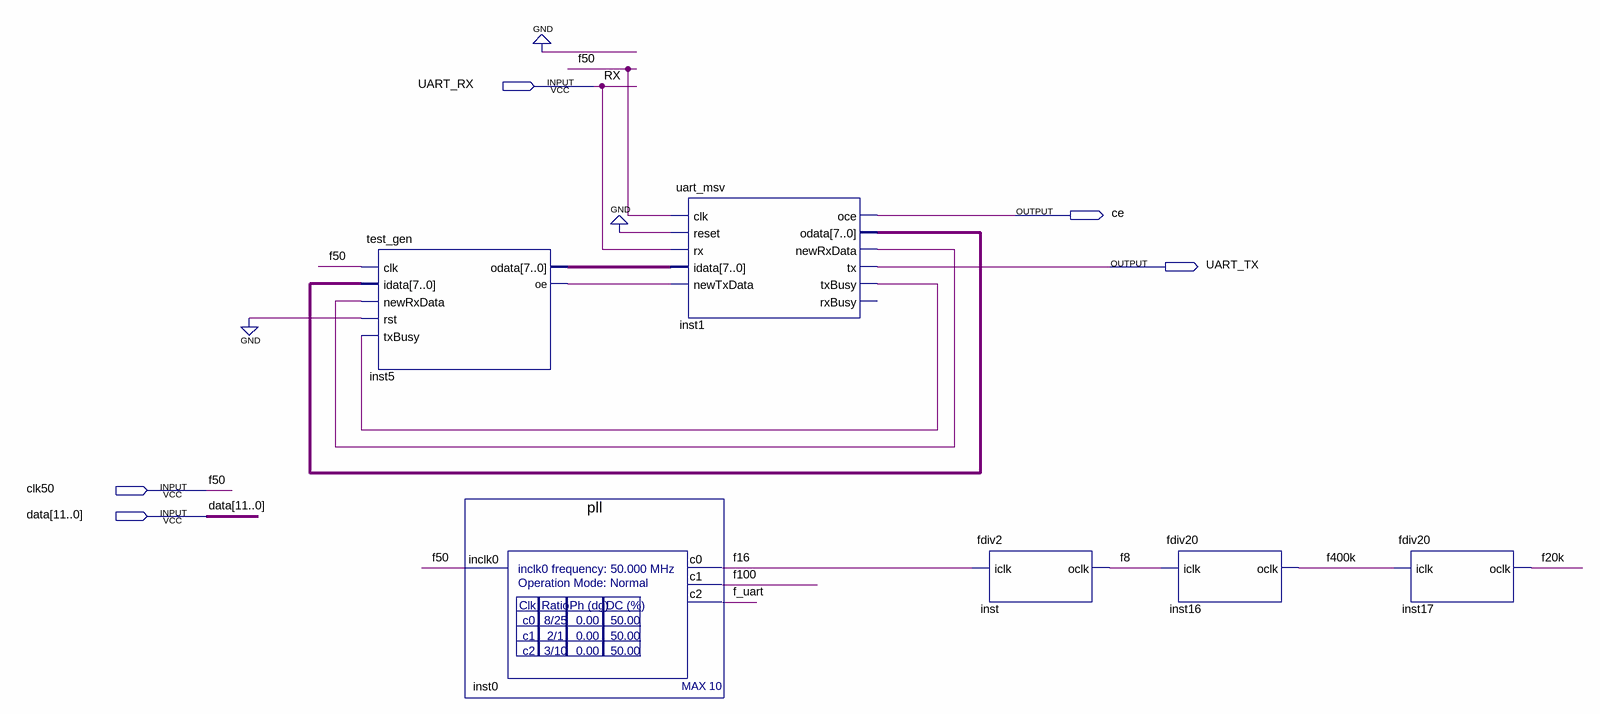
[diagram p0: schematic sheet]
// Quartus schematic UART_test.bdf as structural Verilog: 6 symbols, 5 pins
module UART_test (
  input  UART_RX,
  input  clk50,
  input  [11:0] data,
  output ce,
  output UART_TX
);

  wire f8, f16, f20k, f100, f400k, f_uart, inst1_newrxdata, inst1_txbusy, inst5_oe;
  wire [7:0] inst1_odata, inst5_odata;

  test_gen inst5 (
    .clk(clk50), .idata(inst1_odata), .newRxData(inst1_newrxdata), .rst(1'b0), .txBusy(inst1_txbusy),
    .odata(inst5_odata), .oe(inst5_oe));
  pll inst0 (.inclk0(clk50), .c0(f16), .c1(f100), .c2(f_uart));
  uart_msv inst1 (
    .clk(clk50), .reset(1'b0), .rx(UART_RX), .idata(inst5_odata), .newTxData(inst5_oe), .oce(ce),
    .odata(inst1_odata), .newRxData(inst1_newrxdata), .tx(UART_TX), .txBusy(inst1_txbusy));  // open: rxBusy
  fdiv2 inst (.iclk(f16), .oclk(f8));
  fdiv20 inst16 (.iclk(f8), .oclk(f400k));
  fdiv20 inst17 (.iclk(f400k), .oclk(f20k));

  // Other names for the same wires on the sheet: f50 = clk50; RX = UART_RX
endmodule
